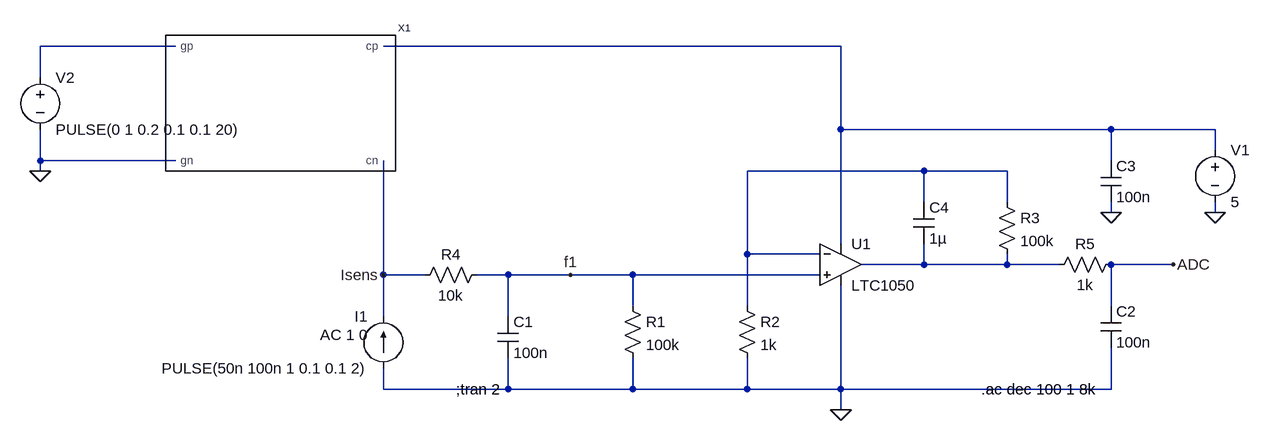
[diagram p0: schematic Draft1.asc]
Draft1.asc, the LTspice schematic file:
Version 4
SHEET 1 1220 680
WIRE -2208 -592 -2416 -592
WIRE -1184 -592 -1888 -592
WIRE -2416 -544 -2416 -592
WIRE -1184 -464 -1184 -592
WIRE -768 -464 -1184 -464
WIRE -608 -464 -768 -464
WIRE -608 -432 -608 -464
WIRE -2416 -416 -2416 -464
WIRE -2208 -416 -2416 -416
WIRE -768 -416 -768 -464
WIRE -2416 -400 -2416 -416
WIRE -1056 -400 -1328 -400
WIRE -928 -400 -1056 -400
WIRE -1056 -352 -1056 -400
WIRE -928 -352 -928 -400
WIRE -768 -336 -768 -352
WIRE -608 -336 -608 -352
WIRE -1184 -288 -1184 -464
WIRE -1328 -272 -1328 -400
WIRE -1216 -272 -1328 -272
WIRE -1056 -256 -1056 -288
WIRE -1056 -256 -1152 -256
WIRE -928 -256 -928 -272
WIRE -928 -256 -1056 -256
WIRE -848 -256 -928 -256
WIRE -672 -256 -768 -256
WIRE -1888 -240 -1888 -416
WIRE -1824 -240 -1888 -240
WIRE -1696 -240 -1744 -240
WIRE -1600 -240 -1696 -240
WIRE -1504 -240 -1600 -240
WIRE -1216 -240 -1504 -240
WIRE -1504 -192 -1504 -240
WIRE -1328 -192 -1328 -272
WIRE -768 -192 -768 -256
WIRE -1888 -176 -1888 -240
WIRE -1696 -176 -1696 -240
WIRE -1888 -64 -1888 -96
WIRE -1696 -64 -1696 -112
WIRE -1696 -64 -1888 -64
WIRE -1504 -64 -1504 -112
WIRE -1504 -64 -1696 -64
WIRE -1328 -64 -1328 -112
WIRE -1328 -64 -1504 -64
WIRE -1184 -64 -1184 -224
WIRE -1184 -64 -1328 -64
WIRE -768 -64 -768 -128
WIRE -768 -64 -1184 -64
WIRE -1184 -32 -1184 -64
FLAG -1184 -32 0
FLAG -672 -256 ADC
FLAG -768 -336 0
FLAG -608 -336 0
FLAG -1600 -240 f1
FLAG -2416 -400 0
FLAG -1888 -240 Isens
SYMBOL res -1728 -256 R90
WINDOW 0 0 56 VBottom 2
WINDOW 3 32 56 VTop 2
SYMATTR InstName R4
SYMATTR Value 10k
SYMBOL res -1520 -208 R0
SYMATTR InstName R1
SYMATTR Value 100k
SYMBOL res -1344 -208 R0
SYMATTR InstName R2
SYMATTR Value 1k
SYMBOL res -944 -368 R0
SYMATTR InstName R3
SYMATTR Value 100k
SYMBOL cap -1712 -176 R0
SYMATTR InstName C1
SYMATTR Value 100n
SYMBOL OpAmps\\LTC1050 -1184 -320 R0
SYMATTR InstName U1
SYMBOL cap -1072 -352 R0
SYMATTR InstName C4
SYMATTR Value 1µ
SYMBOL res -752 -272 R90
WINDOW 0 0 56 VBottom 2
WINDOW 3 32 56 VTop 2
SYMATTR InstName R5
SYMATTR Value 1k
SYMBOL cap -784 -192 R0
SYMATTR InstName C2
SYMATTR Value 100n
SYMBOL cap -784 -416 R0
SYMATTR InstName C3
SYMATTR Value 100n
SYMBOL voltage -608 -448 R0
WINDOW 123 0 0 Left 0
WINDOW 39 0 0 Left 0
SYMATTR InstName V1
SYMATTR Value 5
SYMBOL sensor -2048 -512 R0
SYMATTR InstName X1
SYMBOL voltage -2416 -560 R0
WINDOW 123 0 0 Left 0
WINDOW 39 0 0 Left 0
SYMATTR InstName V2
SYMATTR Value PULSE(0 1 0.2 0.1 0.1 20)
SYMBOL current -1888 -96 R180
WINDOW 0 24 80 Left 2
WINDOW 3 24 0 Left 2
WINDOW 123 24 52 Left 2
WINDOW 39 0 0 Left 0
SYMATTR InstName I1
SYMATTR Value PULSE(50n 100n 1 0.1 0.1 2)
SYMATTR Value2 AC 1 0
TEXT -1776 -64 Left 2 !;tran 2
TEXT -968 -64 Left 2 !.ac dec 100 1 8k

The netlist it stands for:
* Draft1.asc
R4 f1 Isens 10k
R1 f1 0 100k
R2 N003 0 1k
R3 N003 N004 100k
C1 f1 0 100n
XU1 f1 N003 N002 0 N004 LTC1050  ; pins In+ In- V+ V- OUT
C4 N003 N004 1µ
R5 ADC N004 1k
C2 ADC 0 100n
C3 N002 0 100n
V1 N002 0 5
XX1 N002 Isens N001 0 sensor  ; pins cp cn gp gn
V2 N001 0 PULSE(0 1 0.2 0.1 0.1 20)
I1 0 Isens PULSE(50n 100n 1 0.1 0.1 2) AC 1 0
;tran 2
.ac dec 100 1 8k
.lib LTC.lib
.backanno
.end

* Results of the author's LTspice run, read from the files saved beside the schematic
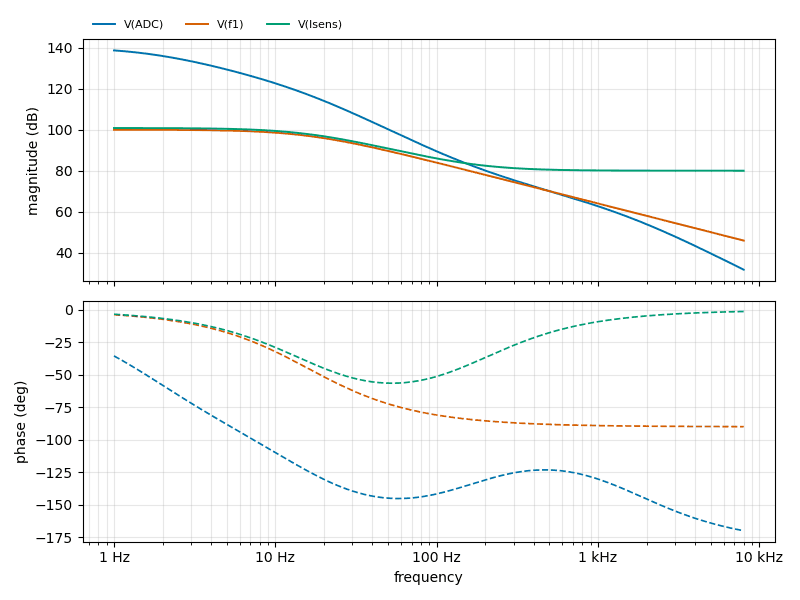
[diagram p1: AC Analysis of Draft1.asc, plotted from the saved traces]
* AC Analysis, 1 run:
*   V(ADC): 138.61 dB at 1 Hz, 31.78 dB at 8 kHz, peak 138.61 dB at 1 Hz, 3 dB below the peak at 2.107 Hz
*   V(f1): 99.97 dB at 1 Hz, 45.97 dB at 8 kHz, peak 99.97 dB at 1 Hz, 3 dB below the peak at 15.99 Hz
*   V(Isens): 100.80 dB at 1 Hz, 80.00 dB at 8 kHz, peak 100.80 dB at 1 Hz, 3 dB below the peak at 16.13 Hz